# Altium project altium.PrjPcb
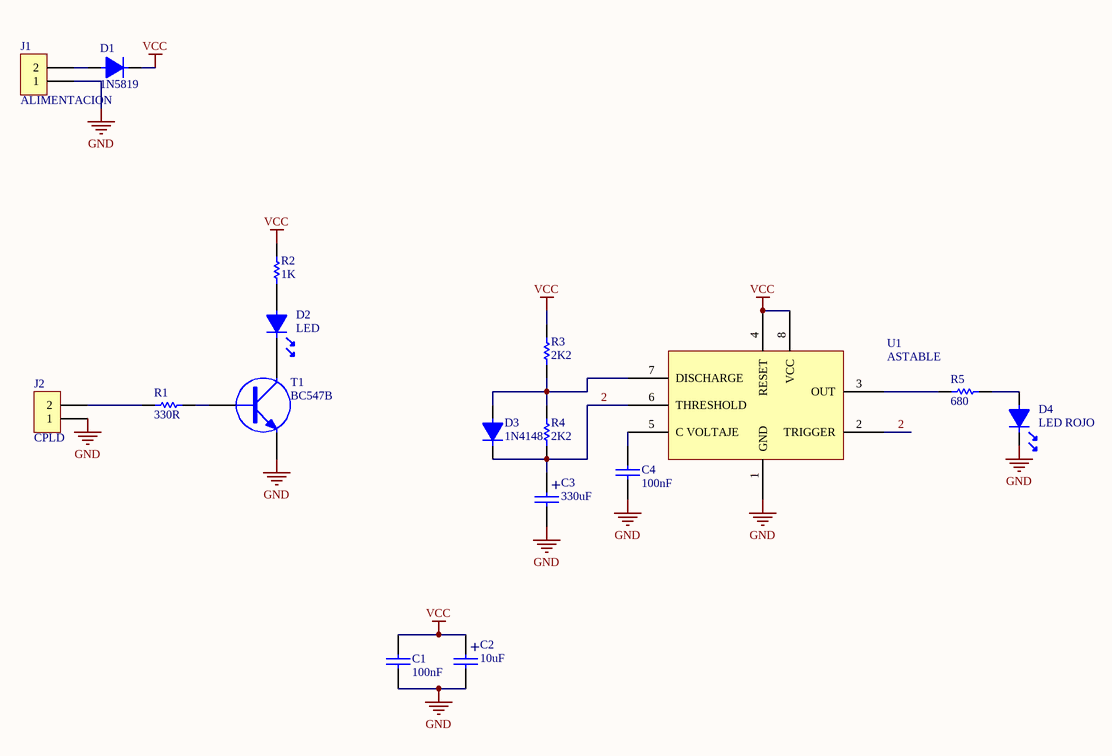
[diagram p0: ESQUEMATICO.SchDoc]
1 sheet, 17 parts. Net scope: global (net labels, ports and power ports of the same name join across sheets).
Board files: PCB.PcbDoc, panel.PcbDoc

## Sheet ESQUEMATICO.SchDoc
size A4

### Parts
C1  100nF  [CAP200]
C2  10uF  [CAP100RP]
C3  330uF  [CAP200RP]
C4  100nF  [CAP200]
D1  1N5819  [DO41]
D2  LED  [LED3]
D3  1N4148  [DO41]
D4  LED ROJO  [LED3]
J1  ALIMENTACION  [BORNERA2]
J2  CPLD  [BORNERA2]
R1  330R  [RES400]
R2  1K  [RES400]
R3  2K2  [RES400]
R4  2K2  [RES400]
R5  680  [RES400]
T1  BC547B  [TO92]
U1  ASTABLE  [DIP8]

### Nets
GND: C1.2 C2.2 C3.2 C4.2 D4.2 J1.1 J2.1 T1.3(E) U1.1(GND)
VCC: C1.1 C2.1 D1.2 R2.2 R3.2 U1.4(RESET) U1.8(VCC)
2: C3.1 D3.2 R4.1 U1.2(TRIGGER) U1.6(THRESHOLD)
NetC4_1: C4.1 U1.5(C_VOLTAJE)
NetD1_1: D1.1 J1.2
NetD2_1: D2.1 R2.1
NetD2_2: D2.2 T1.2(C)
NetD3_1: D3.1 R3.1 R4.2 U1.7(DISCHARGE)
NetD4_1: D4.1 R5.2
NetJ2_2: J2.2 R1.2
NetR1_1: R1.1 T1.1(B)
NetR5_1: R5.1 U1.3(OUT)

### Notes on the sheet
- Title
- Size:
- Date:
- A4
- Number:
- Time:
- Revision:
- Sheet
- of
- File:
- (in symbol CAPPOL) +

### Library data of the parts
C1 C4 = CAP
C2 C3 = CAPPOL
D1 D3 = DIODO
D4 = LED
J1 J2 = BORNERA 2
R1-R5 = RES
T1 = TRANSISTOR NPN
U1 = LM555: Timer